# EAGLE design gnd_kond (EAGLE 6.3)
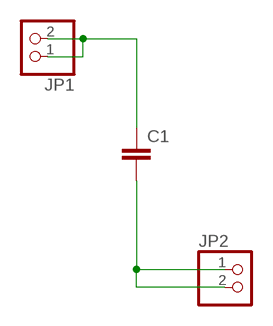
[diagram p0: schematic, sheet 1]

## Parts
C1  C-EU150-091X182  [C150-091X182]
JP1  PINHD-1X2  [1X02]
JP2  PINHD-1X2  [1X02]

## Nets
N$1: C1.1 JP1.1 JP1.2
N$2: C1.2 JP2.1 JP2.2

## Library data of the parts
C1 = rcl:C-EU: CAPACITOR, European symbol
JP1 JP2 = pinhead:PINHD-1X2: PIN HEADER

## Board
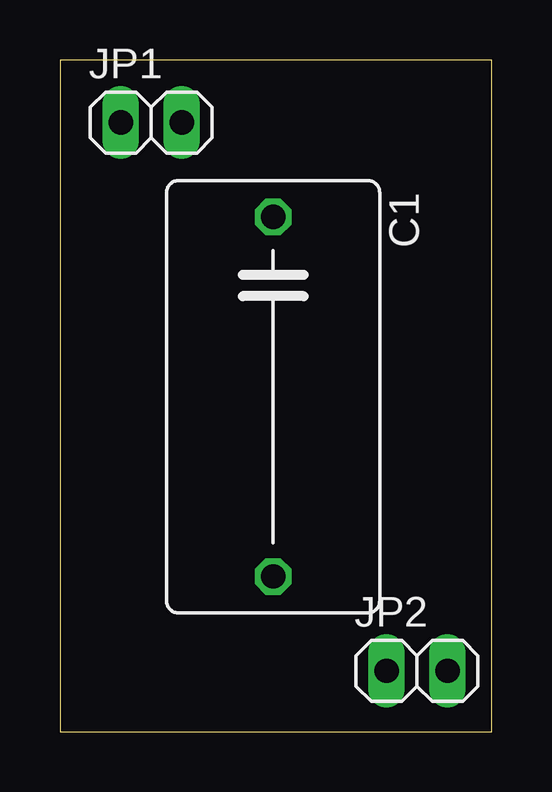
[diagram p1: board, top side]
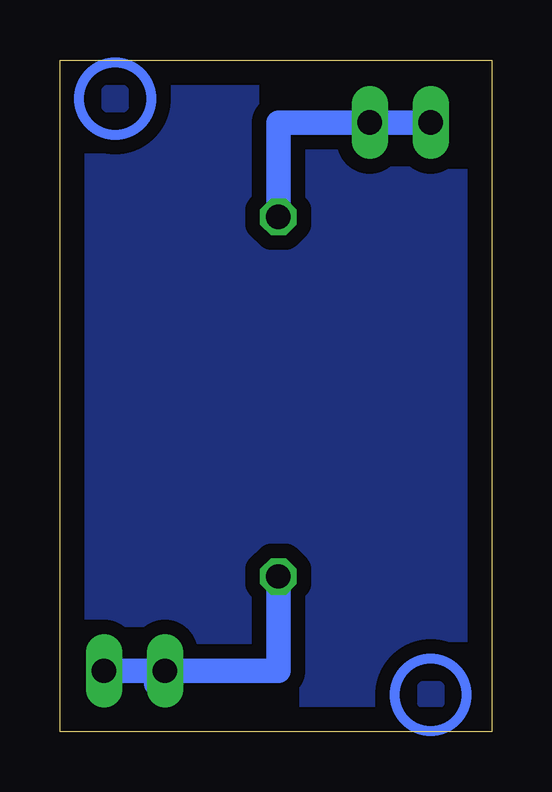
[diagram p2: board, bottom side, seen from below]

Size 18 x 28.01 mm. Coordinates in mm from the lower left corner, seen from the top.
Outline: 0,0 18,0 18,28.01 0,28.01 0,0
Copper layers (1*16): Top 0.035mm / dielectric 1.5mm / Bottom 0.035mm
Design rules "default": minimum track width 10mil, minimum drill 24mil, track to track 8mil, track to pad 8mil, pad to pad 8mil, via to via 8mil, smd to smd 8mil, copper to edge 40mil, drill to drill 8mil, minimum pad ring 10mil, minimum via ring 8mil, stop-mask expansion 4mil, vias tented up to drill 0mil, thermal gap 10mil

### Footprints (pad centres in the part's own frame; a part is rotated, then mirrored left to right if it is on the bottom)
C150-091X182 = drill 1.016 octagon: 1 -7.493,0; 2 7.493,0
1X02 = drill 1.016 long: 1 -1.27,0; 2 1.27,0

### Placement (x,y rotation side)
C1  8.89,13.97 270 top
JP1  3.81,25.4 0 top
JP2  14.89,2.54 0 top

### Tracks (layer width: path | path; a pad name or v marks a point on that pad's centre or on a via)
N$1
  Bottom 1.016: JP1.1 JP1.2 8.89,25.4 C1.1
N$2
  Bottom 1.016: JP2.1 13.62,2 14,2 14,2.54 JP2.2 8.89,2.54 C1.2
N$3
  pour Bottom (isolate 0.61): 0,28 18,28 18,0 0,0
(copper drawn outside any net)
  shapes: Bottom circle x2